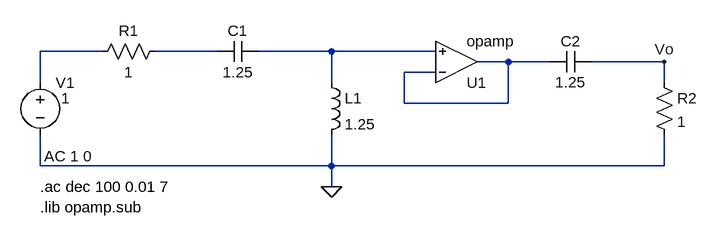
[diagram p0: schematic TS4_Punto3.asc]
TS4_Punto3.asc, the LTspice schematic file:
Version 4
SHEET 1 1016 680
WIRE 96 144 0 144
WIRE 272 144 176 144
WIRE 448 144 336 144
WIRE 608 144 448 144
WIRE 720 160 672 160
WIRE 784 160 720 160
WIRE 960 160 848 160
WIRE 608 176 560 176
WIRE 0 192 0 144
WIRE 448 192 448 144
WIRE 960 192 960 160
WIRE 560 224 560 176
WIRE 720 224 720 160
WIRE 720 224 560 224
WIRE 0 320 0 272
WIRE 448 320 448 272
WIRE 448 320 0 320
WIRE 960 320 960 272
WIRE 960 320 448 320
WIRE 448 352 448 320
FLAG 448 352 0
FLAG 960 160 Vo
SYMBOL res 192 128 R90
WINDOW 0 0 56 VBottom 2
WINDOW 3 32 56 VTop 2
SYMATTR InstName R1
SYMATTR Value 1
SYMBOL cap 336 128 R90
WINDOW 0 0 32 VBottom 2
WINDOW 3 32 32 VTop 2
SYMATTR InstName C1
SYMATTR Value 1.25
SYMBOL ind 432 176 R0
SYMATTR InstName L1
SYMATTR Value 1.25
SYMBOL OpAmps\\opamp 640 224 M180
SYMATTR InstName U1
SYMBOL res 944 176 R0
SYMATTR InstName R2
SYMATTR Value 1
SYMBOL cap 848 144 R90
WINDOW 0 0 32 VBottom 2
WINDOW 3 32 32 VTop 2
SYMATTR InstName C2
SYMATTR Value 1.25
SYMBOL voltage 0 176 R0
WINDOW 3 32 40 Left 2
WINDOW 123 6 129 Left 2
WINDOW 39 0 0 Left 0
SYMATTR InstName V1
SYMATTR Value 1
SYMATTR Value2 AC 1 0
TEXT 0 384 Left 2 !.lib opamp.sub
TEXT 0 352 Left 2 !.ac dec 100 0.01 7

The netlist it stands for:
* TS4_Punto3.asc
R1 N002 N001 1
C1 N003 N002 1.25
L1 N003 0 1.25
XU1 N004 N003 N004 opamp Aol=100K GBW=10Meg  ; pins invin noninvin out
R2 Vo 0 1
C2 Vo N004 1.25
V1 N001 0 1 AC 1 0
.lib opamp.sub
.ac dec 100 0.01 7
.backanno
.end